# Altium schematic sheet Receiver&Transmitter.SchDoc
size A4; SheetNumber: 7; SheetTotal: 7
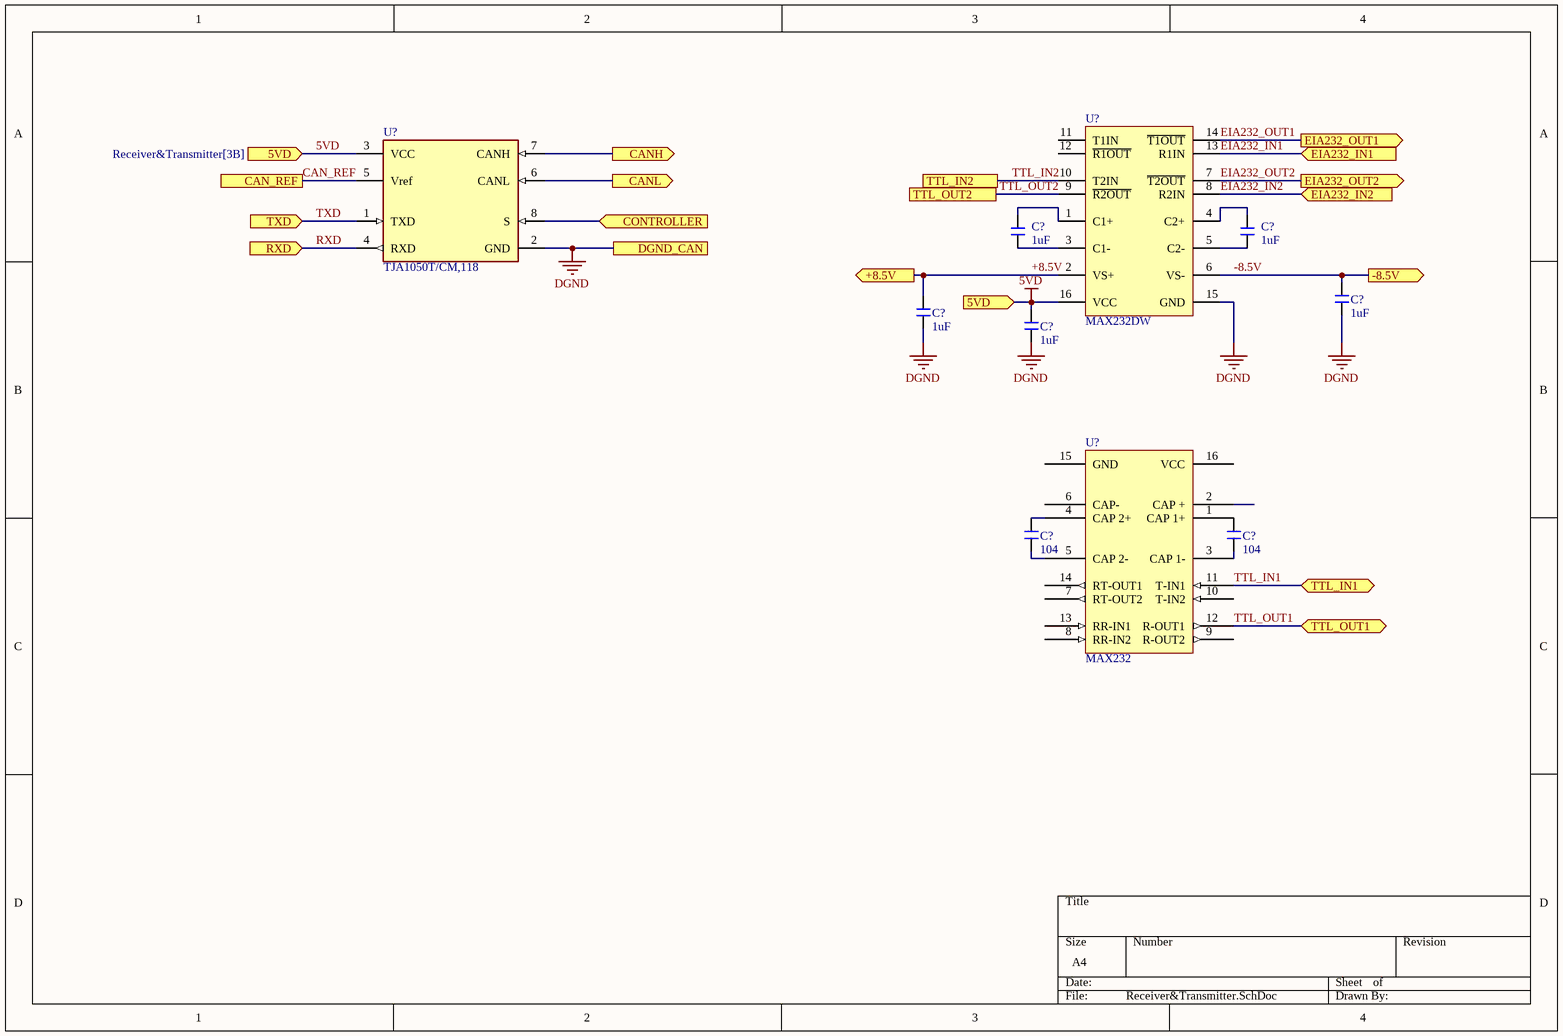
[diagram p0: Receiver&Transmitter.SchDoc]

## Parts
(Parts that share a designator on the sheet are numbered #1, #2 ... from top to bottom, then left to right.)
C?#1  1uF  [C 0805_L]
C?#2  1uF  [C 0805_L]
C?#3  1uF  [C 0805_L]
C?#4  1uF  [C 0805_L]
C?#5  1uF  [C 0805_L]
C?#6  104  [C 0603_L]
C?#7  104  [C 0603_L]
U?#1  MAX232DW  [DW0016A_N]
U?#2  TJA1050T/CM,118  [FP-SOT96-1-IPC_A]
U?#3  MAX232  [SOP16_L]

## Ports
5VD (in, see Receiver&Transmitter[1A]), 5VD (in, see Receiver&Transmitter[3B]), +8.5V (out), -8.5V (out), CAN_REF, CANH (out), CANL (out), CONTROLLER (in), DGND_CAN, EIA232_IN1 (in), EIA232_IN2 (in), EIA232_OUT1 (out), EIA232_OUT2 (out), RXD (in), TTL_IN1 (bidir), TTL_IN2, TTL_OUT1 (bidir), TTL_OUT2, TXD (in)

## Nets
5VD: C?#5.2 U?#1.16(VCC) U?#2.3(VCC) ; port 5VD
DGND: C?#3.1 C?#4.1 C?#5.1 U?#1.15(GND) U?#2.2(GND) ; port DGND_CAN
+8.5V: C?#4.2 U?#1.2(VS+) ; port +8.5V
-8.5V: C?#3.2 U?#1.6(VS-) ; port -8.5V
CAN_REF: U?#2.5(Vref) ; port CAN_REF
CANH: U?#2.7(CANH) ; port CANH
CANL: U?#2.6(CANL) ; port CANL
CONTROLLER: U?#2.8(S) ; port CONTROLLER
EIA232_IN1: U?#1.13(R1IN) ; port EIA232_IN1
EIA232_IN2: U?#1.8(R2IN) ; port EIA232_IN2
EIA232_OUT1: U?#1.14(~{T1OUT}) ; port EIA232_OUT1
EIA232_OUT2: U?#1.7(~{T2OUT}) ; port EIA232_OUT2
RXD: U?#2.4(RXD) ; port RXD
TTL_IN1: U?#3.11(T-IN1) ; port TTL_IN1
TTL_IN2: U?#1.10(T2IN) ; port TTL_IN2
TTL_OUT1: U?#3.12(R-OUT1) ; port TTL_OUT1
TTL_OUT2: U?#1.9(~{R2OUT}) ; port TTL_OUT2
TXD: U?#2.1(TXD) ; port TXD
NetC?#1_1: C?#1.1 U?#1.3(C1-)
NetC?#1_2: C?#1.2 U?#1.1(C1+)
NetC?#2_1: C?#2.1 U?#1.5(C2-)
NetC?#2_2: C?#2.2 U?#1.4(C2+)
NetC?#6_1: C?#6.1 U?#3.4(CAP_2+)
NetC?#6_2: C?#6.2 U?#3.5(CAP_2-)
NetC?#7_1: C?#7.1 U?#3.1(CAP_1+)
NetC?#7_2: C?#7.2 U?#3.3(CAP_1-)

Not connected (* = marked no-connect by the designer): U?#1 11(T1IN) 12(~{R1OUT}); U?#3 2(CAP_+) 6(CAP-) 7(RT-OUT2) 8(RR-IN2) 9(R-OUT2) 10(T-IN2) 13(RR-IN1) 14(RT-OUT1) 15(GND) 16(VCC)

## Library data of the parts
C?#1-C?#7 = C: 贴片电容; BOM名称: 无极性贴片电容; 淘宝ID: 封装库来自淘宝 ID：黄晶宝石; 联系售后，技术支持: https://shop463601444.taobao.com; 唯一出售店铺网址: https://shop463601444.taobao.com
U?#1 = CMP-0299-00141-2: Dual EIA-232 Driver / Receiver, 0 to 70 degC, 16-Pin SOIC (DW), Green (RoHS & no Sb/Br); SubFamily: RS-232; Supply Voltage(s)(V): 5; ICC(Max)(mA): 10; RS-232: TRUE; Drivers Per Package: 2; ESD HBM(kV): +/-2; ComponentLink1Description: Manufacturer URL; PackageDescription: 16-Pin Small Outline Integrated Circuit, 10.3 x 7.5 mm, Pitch 1.27 mm Pitch; PackageVersion: revG, Jan-2011; DatasheetVersion: SLLS047L; Single Supply: TRUE; ComponentLink2URL: http://www.ti.com/general/docs/lit/getliterature.tsp?genericPartNumber=MAX232&fileType=pdf; ComponentLink1URL: www.ti.com; ComponentLink3URL: http://www.ti.com/litv/pdf/msoi003g; ComponentLink2Description: Datasheet; Receivers Per Package: 2; PackageReference: DW0016A; ComponentLink3Description: Package Specification
U?#2 = CMP-2000-04923-2: IC TRANSCEIVER HALF 1/1 8SO; Simplex/Duplex: Half Duplex; Max Supply Current: 10mA; Number of Receive Buffers: 1; Min Supply Voltage: 4.75V; Max Supply Voltage: 5.25V; Interface: CAN; Data Rate: 1Mbps; Receiver Hysteresis: 70mV; Number of Transmit Buffers: 1; Min Operating Temperature: -40°C; Case/Package: SO; REACH SVHC: No SVHC; Max Operating Temperature: 150°C; Number of Pins: 8; Lead Free: Lead Free; Number of Transceivers: 1; Packaging: Tape and Reel; Mount: Surface Mount; Radiation Hardening: No; Nominal Supply Current: 10mA; Package Quantity: 2500; Contact Plating: Gold
U?#3 = MAX232: 通讯IC; 淘宝ID: 黄晶宝石; 欢迎光临: https://shop463601444.taobao.com